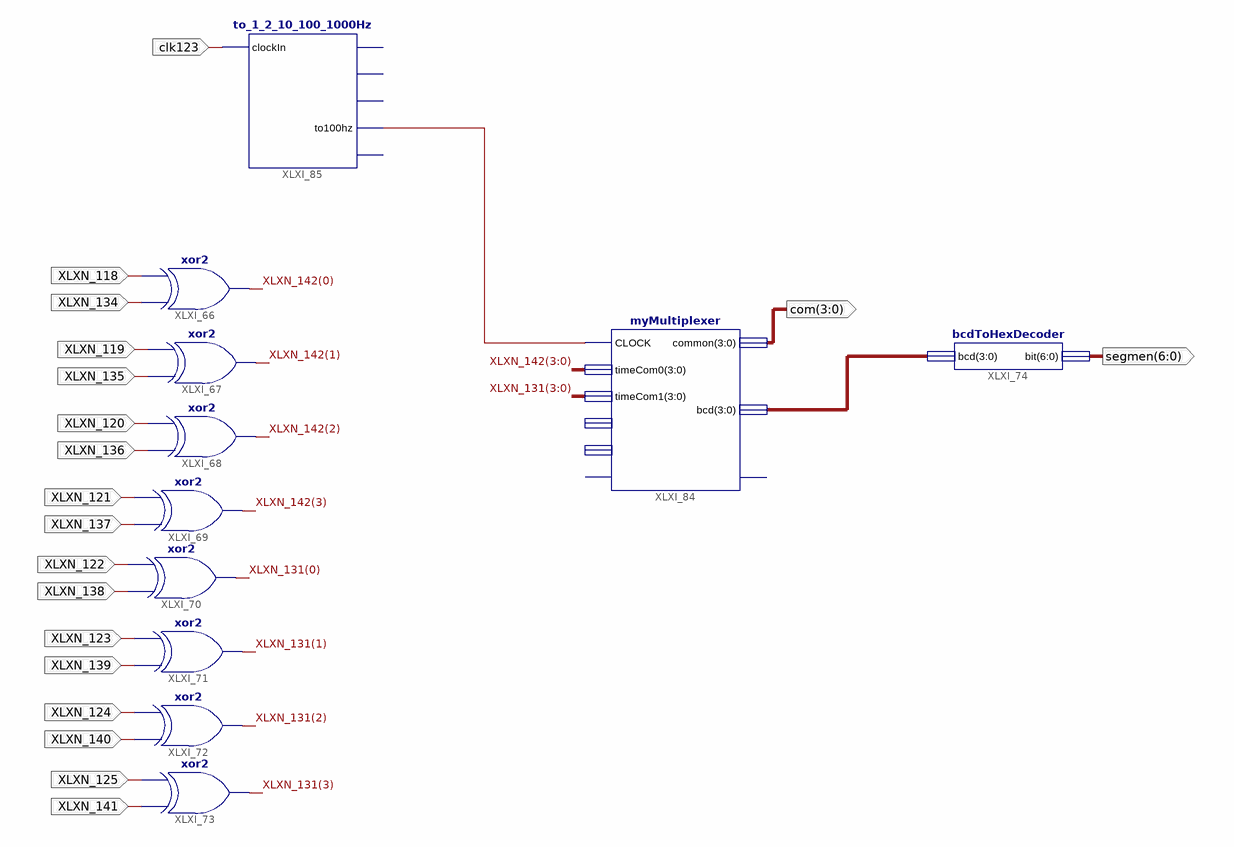
[diagram p0: schematic sheet 1]
// Xilinx ISE schematic test.sch (spartan6) as structural Verilog: 11 symbols, 19 ports
module test (
  input  XLXN_118,
  input  XLXN_119,
  input  XLXN_120,
  input  XLXN_121,
  input  XLXN_122,
  input  XLXN_123,
  input  XLXN_124,
  input  XLXN_125,
  input  XLXN_134,
  input  XLXN_135,
  input  XLXN_136,
  input  XLXN_137,
  input  XLXN_138,
  input  XLXN_139,
  input  XLXN_140,
  input  XLXN_141,
  input  clk123,
  output [3:0] com,
  output [6:0] segmen
);

  wire XLXN_158;
  wire [3:0] XLXN_131, XLXN_142, XLXN_161;

  xor XLXI_66 (XLXN_142[0], XLXN_134, XLXN_118);
  xor XLXI_67 (XLXN_142[1], XLXN_135, XLXN_119);
  xor XLXI_68 (XLXN_142[2], XLXN_136, XLXN_120);
  xor XLXI_69 (XLXN_142[3], XLXN_137, XLXN_121);
  xor XLXI_70 (XLXN_131[0], XLXN_138, XLXN_122);
  xor XLXI_71 (XLXN_131[1], XLXN_139, XLXN_123);
  xor XLXI_72 (XLXN_131[2], XLXN_140, XLXN_124);
  xor XLXI_73 (XLXN_131[3], XLXN_141, XLXN_125);
  bcdToHexDecoder XLXI_74 (.bcd(XLXN_161), .\bit (segmen));
  myMultiplexer XLXI_84 (
    .CLOCK(XLXN_158), .timeCom0(XLXN_142), .timeCom1(XLXN_131), .common(com), .bcd(XLXN_161));  // open: timeCom2, timeCom3, beepIn, beepOut
  to_1_2_10_100_1000Hz XLXI_85 (.clockIn(clk123), .to100hz(XLXN_158));  // open: to1hz, to2hz, to10hz, to1000hz
endmodule
